# Altium project IoT_Prj.PrjPCB
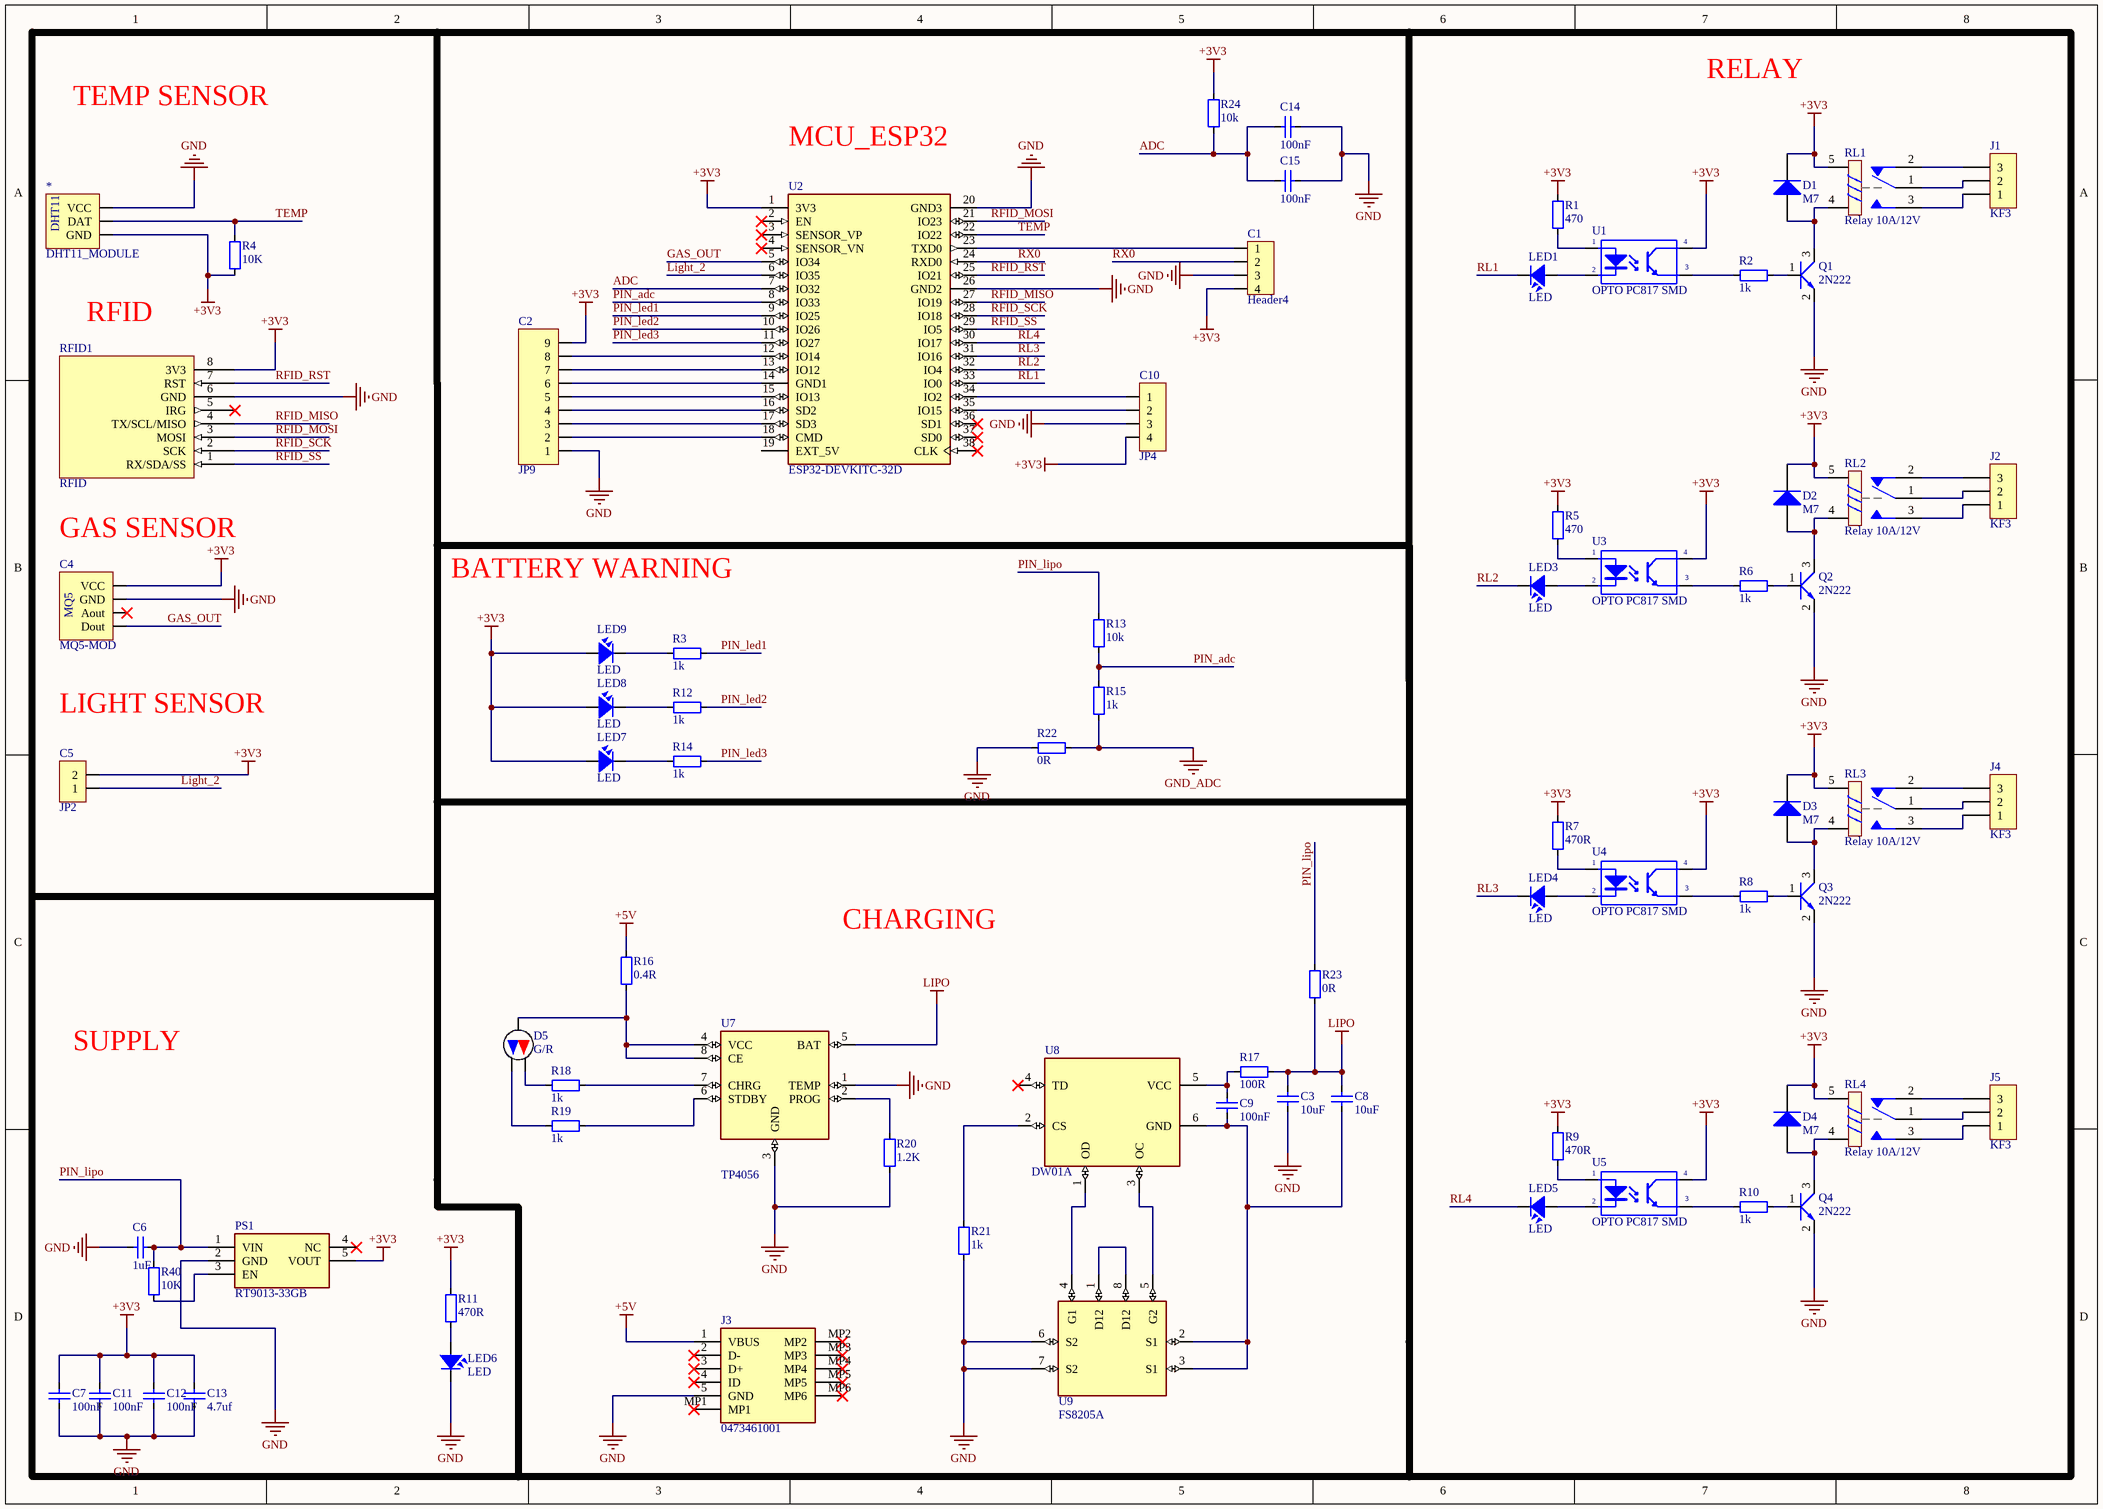
[diagram p0: Schematic_Devices.SchDoc]
1 sheet, 77 parts. Net scope: global (net labels, ports and power ports of the same name join across sheets).
Board file: PCB_Devices.PcbDoc

## Sheet Schematic_Devices.SchDoc
size A3

### Parts
*  DHT11_MODULE  [DHT11_MODULE]
C1  Header4  [HDR4]
C2  JP9  [JP9-C1T]
C3  10uF  [CAP_0805]
C4  MQ5-MOD  [JP4-C1T]
C5  JP2  [JP2-C1T]
C6  1uF  [CAP_0805]
C7  100nF  [CAP_0805]
C8  10uF  [CAP_0805]
C9  100nF  [CAP_0805]
C10  JP4  [JP4-C1T]
C11  100nF  [CAP_0805]
C12  100nF  [CAP_0805]
C13  4.7uf  [CAP_0805]
C14  100nF  [CAP_0805]
C15  100nF  [CAP_0805]
D1  M7  [DO-214AC(SMA)]
D2  M7  [DO-214AC(SMA)]
D3  M7  [DO-214AC(SMA)]
D4  M7  [DO-214AC(SMA)]
D5  G/R  [LED_3MM_DUAL RA]
J1  KF3  [KF3-5.08]
J2  KF3  [KF3-5.08]
J3  0473461001  [USB-M1]
J4  KF3  [KF3-5.08]
J5  KF3  [KF3-5.08]
LED1  LED  [LED-0805-Red]
LED3  LED  [LED-0805-Red]
LED4  LED  [LED-0805-Red]
LED5  LED  [LED-0805-Red]
LED6  LED  [LED-0805-Blue]
LED7  LED  [LED-0805-Orange]
LED8  LED  [LED-0805-Orange]
LED9  LED  [LED-0805-Blue]
PS1  RT9013-33GB  [SOT94P279X130-5N]
Q1  2N222  [SOT23D]
Q2  2N222  [SOT23D]
Q3  2N222  [SOT23D]
Q4  2N222  [SOT23D]
R1  470  [RES-SMD-0805]
R2  1k  [RES-SMD-0805]
R3  1k  [RES-SMD-0805]
R4  10K  [RES-SMD-0805]
R5  470  [RES-SMD-0805]
R6  1k  [RES-SMD-0805]
R7  470R  [RES-SMD-0805]
R8  1k  [RES-SMD-0805]
R9  470R  [RES-SMD-0805]
R10  1k  [RES-SMD-0805]
R11  470R  [RES-SMD-0805]
R12  1k  [RES-SMD-0805]
R13  10k  [RES-SMD-0805]
R14  1k  [RES-SMD-0805]
R15  1k  [RES-SMD-0805]
R16  0.4R  [RES-SMD-0805]
R17  100R  [RES-SMD-0805]
R18  1k  [RES-SMD-0805]
R19  1k  [RES-SMD-0805]
R20  1.2K  [RES-SMD-0805]
R21  1k  [RES-SMD-0805]
R22  0R  [RES-SMD-0805]
R23  0R  [RES-SMD-0805]
R24  10k  [RES-SMD-0805]
R40  10K  [RES-SMD-0805]
RFID1  RFID  [RFID RC522]
RL1  Relay 10A/12V  [RELAY5PIN-10A]
RL2  Relay 10A/12V  [RELAY5PIN-10A]
RL3  Relay 10A/12V  [RELAY5PIN-10A]
RL4  Relay 10A/12V  [RELAY5PIN-10A]
U1  OPTO PC817 SMD  [OPTO_SMD]
U2  ESP32-DEVKITC-32D  [MODULE_ESP32-DEVKITC-32D]
U3  OPTO PC817 SMD  [OPTO_SMD]
U4  OPTO PC817 SMD  [OPTO_SMD]
U5  OPTO PC817 SMD  [OPTO_SMD]
U7  TP4056  [TP4056]
U8  DW01A  [SOT23-6]
U9  FS8205A  [FS8205A]

### Nets
+3V3: *.1(GND) C1.4 C2.9 C4.4(VCC) C5.2 C7.2 C10.4 C11.2 C12.2 C13.2 D1.2(K) D2.2(K) D3.2(K) D4.2(K) LED7.1 LED8.1 LED9.1 PS1.5(VOUT) R1.1 R4.1 R5.1 R7.1 R9.1 R11.1 R24.2 RFID1.8(3V3) RL1.5 RL2.5 RL3.5 RL4.5 U1.4(C) U2.1(3V3) U3.4(C) U4.4(C) U5.4(C)
+5V: J3.1(VBUS) R16.2
GND: *.3(VCC) C1.3 C2.1 C3.1 C4.3(GND) C6.1 C7.1 C10.3 C11.1 C12.1 C13.1 C14.2 C15.2 J3.5(GND) LED6.2 PS1.2(GND) Q1.2(E) Q2.2(E) Q3.2(E) Q4.2(E) R20.1 R21.1 R22.2 RFID1.6(GND) U2.20(GND3) U2.26(GND2) U7.1(TEMP) U7.3(GND) U9.6(S2) U9.7(S2)
GND_ADC: R15.1 R22.1
LIPO: C3.2 C8.2 R17.1 R23.2 U7.5(BAT)
ADC: C14.1 C15.1 R24.1 U2.7(IO32)
GAS_OUT: C4.1(Dout) U2.5(IO34)
Light_2: C5.1 U2.6(IO35)
PIN_adc: R13.1 R15.2 U2.8(IO33)
PIN_led1: R3.2 U2.9(IO25)
PIN_led2: R12.2 U2.10(IO26)
PIN_led3: R14.2 U2.11(IO27)
PIN_lipo: C6.2 PS1.1(VIN) R13.2 R23.1 R40.2
RFID_MISO: RFID1.4(TX/SCL/MISO) U2.27(IO19)
RFID_MOSI: RFID1.3(MOSI) U2.21(IO23)
RFID_RST: RFID1.7(RST) U2.25(IO21)
RFID_SCK: RFID1.2(SCK) U2.28(IO18)
RFID_SS: RFID1.1(RX/SDA/SS) U2.29(IO5)
RL1: LED1.2 U2.33(IO0)
RL2: LED3.2 U2.32(IO4)
RL3: LED4.2 U2.31(IO16)
RL4: LED5.2 U2.30(IO17)
RX0: C1.2 U2.24(RXD0)
TEMP: *.2(DAT) R4.2 U2.22(IO22)
NetC1_1: C1.1 U2.23(TXD0)
NetC2_2: C2.2 U2.18(CMD)
NetC2_3: C2.3 U2.17(SD3)
NetC2_4: C2.4 U2.16(SD2)
NetC2_5: C2.5 U2.15(IO13)
NetC2_6: C2.6 U2.14(GND1)
NetC2_7: C2.7 U2.13(IO12)
NetC2_8: C2.8 U2.12(IO14)
NetC8_1: C8.1 C9.1 U8.6(GND) U9.2(S1) U9.3(S1)
NetC9_2: C9.2 R17.2 U8.5(VCC)
NetC10_1: C10.1 U2.34(IO2)
NetC10_2: C10.2 U2.35(IO15)
NetD1_1: D1.1(A) Q1.3(C) RL1.4
NetD2_1: D2.1(A) Q2.3(C) RL2.4
NetD3_1: D3.1(A) Q3.3(C) RL3.4
NetD4_1: D4.1(A) Q4.3(C) RL4.4
NetD5_1: D5.1(KR) R19.1
NetD5_2: D5.2(A) R16.1 U7.4(VCC) U7.8(CE)
NetD5_3: D5.3(KB) R18.1
NetJ1_1: J1.1 RL1.3
NetJ1_2: J1.2 RL1.1
NetJ1_3: J1.3 RL1.2
NetJ2_1: J2.1 RL2.3
NetJ2_2: J2.2 RL2.1
NetJ2_3: J2.3 RL2.2
NetJ4_1: J4.1 RL3.3
NetJ4_2: J4.2 RL3.1
NetJ4_3: J4.3 RL3.2
NetJ5_1: J5.1 RL4.3
NetJ5_2: J5.2 RL4.1
NetJ5_3: J5.3 RL4.2
NetLED1_1: LED1.1 U1.2(K)
NetLED3_1: LED3.1 U3.2(K)
NetLED4_1: LED4.1 U4.2(K)
NetLED5_1: LED5.1 U5.2(K)
NetLED6_1: LED6.1 R11.2
NetLED7_2: LED7.2 R14.1
NetLED8_2: LED8.2 R12.1
NetLED9_2: LED9.2 R3.1
NetPS1_3: PS1.3(EN) R40.1
NetQ1_1: Q1.1(B) R2.2
NetQ2_1: Q2.1(B) R6.2
NetQ3_1: Q3.1(B) R8.2
NetQ4_1: Q4.1(B) R10.2
NetR1_2: R1.2 U1.1(A)
NetR2_1: R2.1 U1.3(E)
NetR5_2: R5.2 U3.1(A)
NetR6_1: R6.1 U3.3(E)
NetR7_2: R7.2 U4.1(A)
NetR8_1: R8.1 U4.3(E)
NetR9_2: R9.2 U5.1(A)
NetR10_1: R10.1 U5.3(E)
NetR18_2: R18.2 U7.7(CHRG)
NetR19_2: R19.2 U7.6(STDBY)
NetR20_2: R20.2 U7.2(PROG)
NetR21_2: R21.2 U8.2(CS)
NetU8_1: U8.1(OD) U9.4(G1)
NetU8_3: U8.3(OC) U9.5(G2)
NetU9_1: U9.1(D12) U9.8(D12)

Not connected (* = marked no-connect by the designer): C4 2(Aout)*; J3 2(D-)* 3(D+)* 4(ID)* MP1* MP2* MP3* MP4* MP5* MP6*; PS1 4(NC)*; RFID1 5(IRG)*; U2 2(EN)* 3(SENSOR_VP)* 4(SENSOR_VN)* 19(EXT_5V) 36(SD1)* 37(SD0)* 38(CLK)*; U8 4(TD)*

### Notes on the sheet
- TEMP SENSOR
- RELAY
- MCU_ESP32
- RFID
- GAS SENSOR
- BATTERY WARNING
- LIGHT SENSOR
- CHARGING
- SUPPLY
- (in symbol DHT11_MODULE) DHT11
- (in symbol MQ5-MOD) MQ5

### Library data of the parts
C1 = Header4: Header IDC, 4 x 1 Pin Vertical 2.54mm Pitch (Non-Boxed, Male); Manufacturer: W¨¹rth Elektronik eiSos GmbH; partNo: 613002143121; ComponentLink1 Description: Manufacturer; ComponentLink2 Description: Datasheet; NoPins: 02; Created Date: 29 March 2013; ComponentLink1URL: http://www.we-online.com; ComponentLink2URL: http://katalog.we-online.de/em/datasheet/6130xx143121.pdf; Created by: Karrer Zheng
C2 = JP9: WR-PHD 2.54 mm Angled Socket Header; Manufacturer: W¨¹rth Elektronik eiSos GmbH; partNo: 613009143121; ComponentLink1 Description: Manufacturer; ComponentLink2 Description: Datasheet; NoPins: 09; Created Date: 29 March 2013; ComponentLink1URL: http://www.we-online.com; ComponentLink2URL: http://katalog.we-online.de/em/datasheet/6130xx143121.pdf; Created by: Karrer Zheng
C3 C6-C9 C11-C15 = CapSMD: Capacitor; Value: 33p; Published: 8-Jun-2000; LatestRevisionDate: 17-Jul-2002; LatestRevisionNote: Re-released for DXP Platform.; PackageReference: RAD-0.3; Publisher: Altium Limited
C4 = MQ5-MOD: Manufacturer: W¨¹rth Elektronik eiSos GmbH; partNo: 613004143121; ComponentLink1 Description: Manufacturer; ComponentLink2 Description: Datasheet; NoPins: 04; Created Date: 29 March 2013; ComponentLink1URL: http://www.we-online.com; ComponentLink2URL: http://katalog.we-online.de/em/datasheet/6130xx143121.pdf; Created by: Karrer Zheng
C5 = JP2: WR-PHD 2.54 mm Angled Socket Header; Manufacturer: W¨¹rth Elektronik eiSos GmbH; partNo: 613002143121; ComponentLink1 Description: Manufacturer; ComponentLink2 Description: Datasheet; NoPins: 02; Created Date: 29 March 2013; ComponentLink1URL: http://www.we-online.com; ComponentLink2URL: http://katalog.we-online.de/em/datasheet/6130xx143121.pdf; Created by: Karrer Zheng
C10 = JP4: WR-PHD 2.54 mm Angled Socket Header; Manufacturer: W¨¹rth Elektronik eiSos GmbH; partNo: 613004143121; ComponentLink1 Description: Manufacturer; ComponentLink2 Description: Datasheet; NoPins: 04; Created Date: 29 March 2013; ComponentLink1URL: http://www.we-online.com; ComponentLink2URL: http://katalog.we-online.de/em/datasheet/6130xx143121.pdf; Created by: Karrer Zheng
D1-D4 = Diode M7 ( 4007 ): Dán; Don_Vi: Con; Ten_Linh_Kien: Diode M7 1N4007 SMD 1A 1000V; Ma_Hang: MH000944; Chung_Loai: Dán; Ghi_Chu: *
D5 = LED_3MM_RA: LED BLUE/RED DIFFUSED T-1 T/H 3MM; MFR: SunLED; MPN: XLMDKCBD34M; Solder: WAVE; Value: B/R LED; Category: Optoelectronics; PinCount: 3; URL: https://item.taobao.com/item.htm?spm=a230r.1.14.6.66213402V6WLYs&id=605186082192&ns=1&abbucket=1#detail
J1 J2 J4 J5 = KF3: Manufacturer: Würth Elektronik eiSos GmbH; partNo: 691103110003; ComponentLink1 Description: Manufacturer; ComponentLink2 Description: Datasheet; NoPins: 3; Created Date: 29 October 2013; ComponentLink1URL: http://www.we-online.com; ComponentLink2URL: http://katalog.we-online.de/em/datasheet/6911031100xx.pdf; Created by: Karrer Zheng
J3 = 0473461001: Connector; Manufacturer_Name: Molex; Datasheet Link: https://componentsearchengine.com/Datasheets/1/0473461001.pdf; Height: 2.45mm; Manufacturer_Part_Number: 0473461001; Mouser Part Number: N/A; Mouser Price/Stock: https://www.mouser.co.uk/ProductDetail/Molex/0473461001?qs=2bnkQPT%252BPafTZgGVt%2FOGfA%3D%3D; Arrow Part Number: 0473461001; Arrow Price/Stock: https://www.arrow.com/en/products/0473461001/molex?region=nac
LED1 LED3-LED9 = LED: LED Single colour Green and Red; Value: LED 3 ly Single Colour
PS1 = RT9013-33GB: Power Supply; Manufacturer_Name: RICHTEK; Datasheet Link: https://www.richtek.com/assets/product_file/RT9013/DS9013-10.pdf; Height: 1.295mm; Manufacturer_Part_Number: RT9013-33GB
Q1-Q4 = 2N222: NPN 600mW, ECB; Value: C1815
R1-R24 R40 = Resistor - SMD: Resistor; Manufacturer: Generic Components; Class: Passive; Published: 08/06/2000; Publisher: Altium Hobart Technology Centre
RFID1 = RFID RC522
RL1-RL4 = Relay 5: Relay SPDT,10A - 12VDC 5 Pin; Value: Relay SPDT, 10A, 12V
U1 U3-U5 = OPTO PC817 SMD: Single Opto; Value: PC817
U2 = ESP32-DEVKITC-32D: EVAL BOARD FOR ESP-WROOM-32; MF: Espressif Systems; Value: *; MP: ESP32-DEVKITC-32D; Price: None; Check_prices: https://www.snapeda.com/parts/ESP32-DEVKITC-32D/Espressif%20Systems/view-part/2777395/?ref=eda; SnapEDA_Link: https://www.snapeda.com/parts/ESP32-DEVKITC-32D/Espressif%20Systems/view-part/2777395/?ref=snap; Availability: Warning; Purchase-URL: https://pricing.snapeda.com/search/part/ESP32-DEVKITC-32D/?ref=eda; Package: None
U7 = TP4056: Complete single cell Li-Ion battery with a constant current / constant voltage linear charger
U8 = DW01A: One Cell Lithium-ion/Polymer Battery Protection IC